# EAGLE design SparkFun_decade_resistance_box (EAGLE 6.5.0)
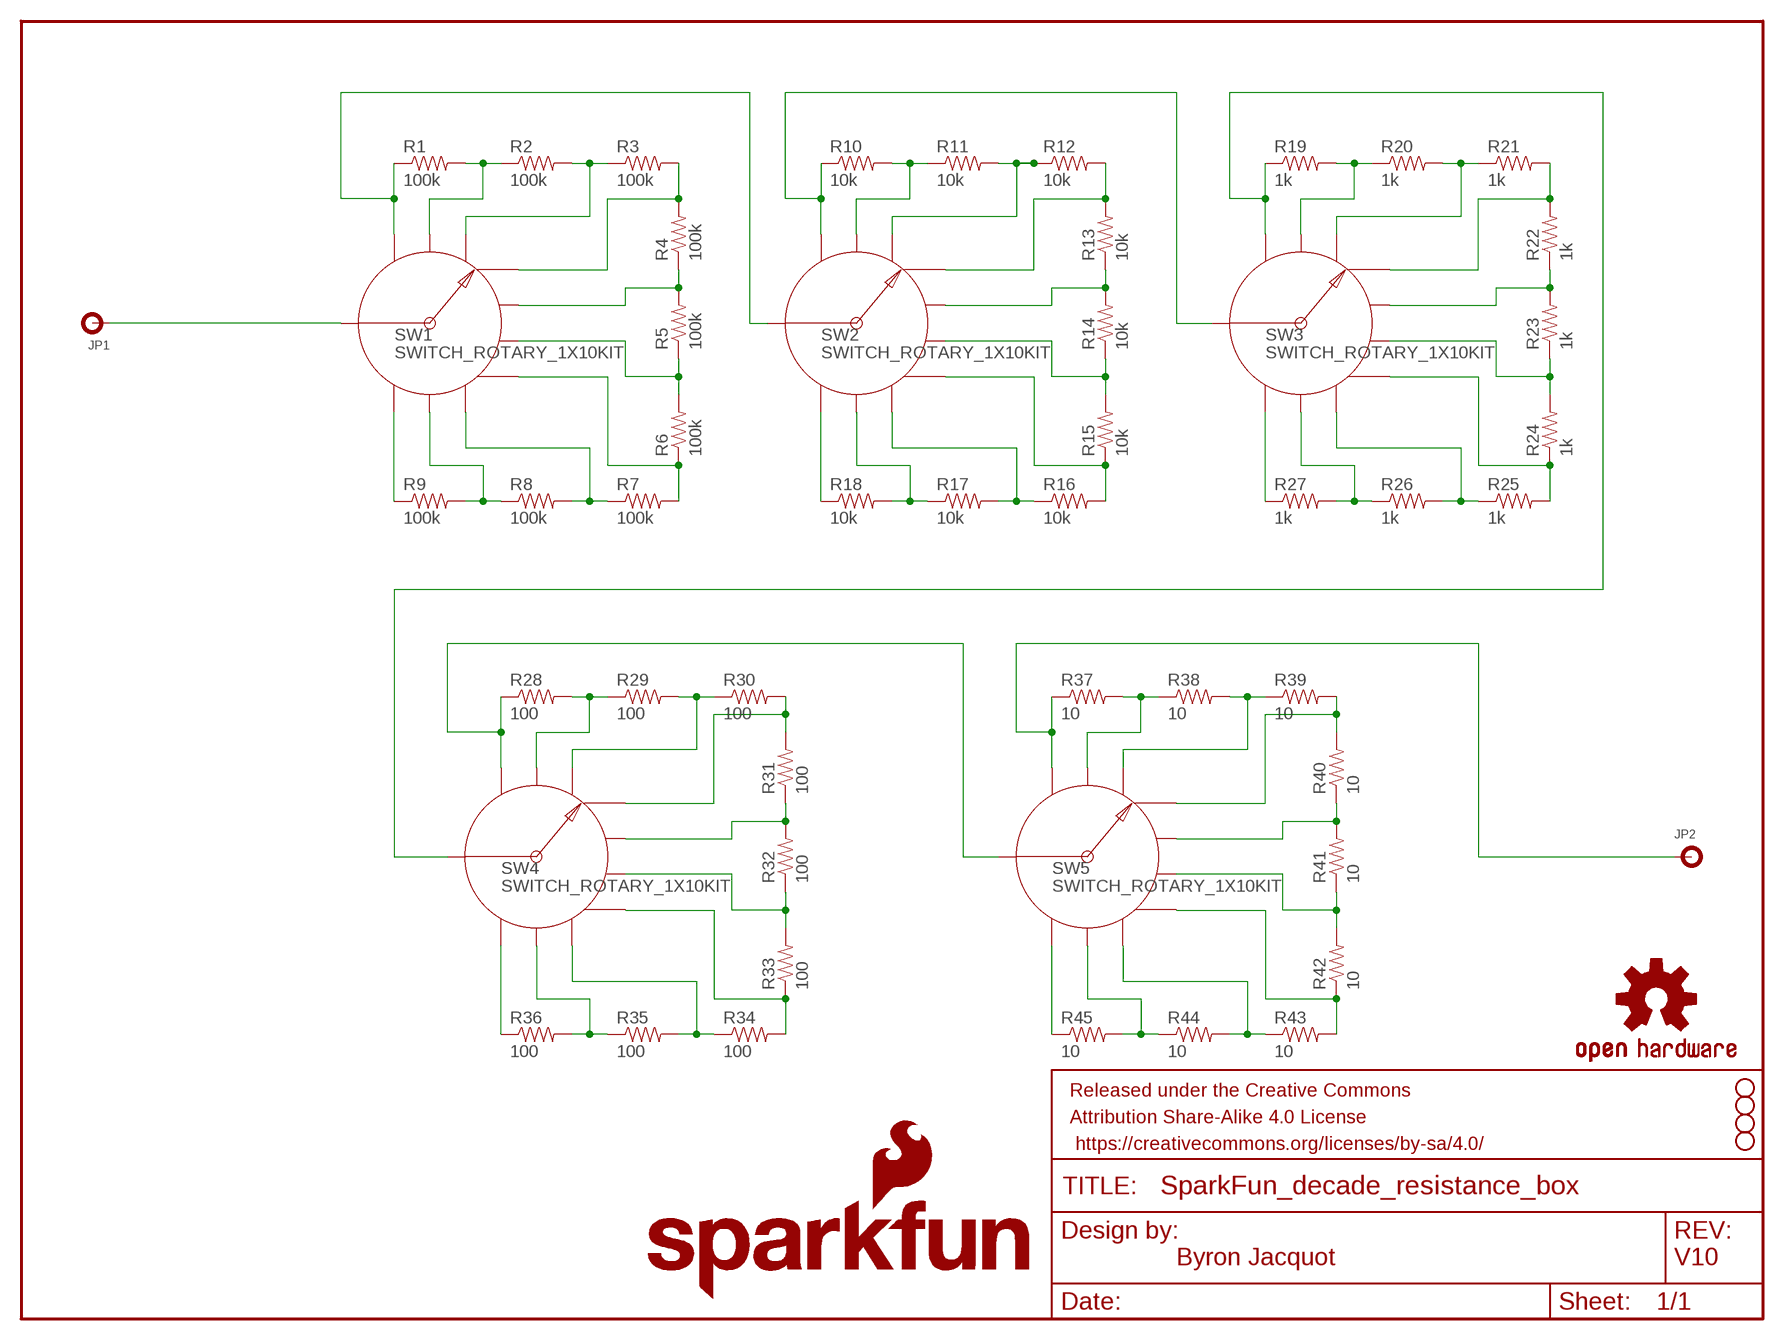
[diagram p0: schematic, sheet 1]

## Parts
FRAME1  FRAME-LETTER  [CREATIVE_COMMONS]
JP1  BANANA-JACK  [BANANA-JACK]
JP2  BANANA-JACK  [BANANA-JACK]
LOGO1  OSHW-LOGOL  [OSHW-LOGO-L]
LOGO2  SFE_LOGO_NAME_FLAME.2_INCH  [SFE_LOGO_NAME_FLAME_.2]
LOGO3  SFE_LOGO_NAME_FLAME.5_INCH  [SFE_LOGO_NAME_FLAME_.5]
LOGO4  OSHW-LOGOL  [OSHW-LOGO-L]
R1  100k  100KOHM-1/4W-1%(PTH)VERT-KIT  [AXIAL-0.1EZ]
R2  100k  100KOHM-1/4W-1%(PTH)VERT-KIT  [AXIAL-0.1EZ]
R3  100k  100KOHM-1/4W-1%(PTH)VERT-KIT  [AXIAL-0.1EZ]
R4  100k  100KOHM-1/4W-1%(PTH)VERT-KIT  [AXIAL-0.1EZ]
R5  100k  100KOHM-1/4W-1%(PTH)VERT-KIT  [AXIAL-0.1EZ]
R6  100k  100KOHM-1/4W-1%(PTH)VERT-KIT  [AXIAL-0.1EZ]
R7  100k  100KOHM-1/4W-1%(PTH)VERT-KIT  [AXIAL-0.1EZ]
R8  100k  100KOHM-1/4W-1%(PTH)VERT-KIT  [AXIAL-0.1EZ]
R9  100k  100KOHM-1/4W-1%(PTH)VERT-KIT  [AXIAL-0.1EZ]
R10  10k  10KOHM-1/4W-1%(PTH)VERT-KIT  [AXIAL-0.1EZ]
R11  10k  10KOHM-1/4W-1%(PTH)VERT-KIT  [AXIAL-0.1EZ]
R12  10k  10KOHM-1/4W-1%(PTH)VERT-KIT  [AXIAL-0.1EZ]
R13  10k  10KOHM-1/4W-1%(PTH)VERT-KIT  [AXIAL-0.1EZ]
R14  10k  10KOHM-1/4W-1%(PTH)VERT-KIT  [AXIAL-0.1EZ]
R15  10k  10KOHM-1/4W-1%(PTH)VERT-KIT  [AXIAL-0.1EZ]
R16  10k  10KOHM-1/4W-1%(PTH)VERT-KIT  [AXIAL-0.1EZ]
R17  10k  10KOHM-1/4W-1%(PTH)VERT-KIT  [AXIAL-0.1EZ]
R18  10k  10KOHM-1/4W-1%(PTH)VERT-KIT  [AXIAL-0.1EZ]
R19  1k  1KOHM-1/4W-1%(PTH)VERT-KIT  [AXIAL-0.1EZ]
R20  1k  1KOHM-1/4W-1%(PTH)VERT-KIT  [AXIAL-0.1EZ]
R21  1k  1KOHM-1/4W-1%(PTH)VERT-KIT  [AXIAL-0.1EZ]
R22  1k  1KOHM-1/4W-1%(PTH)VERT-KIT  [AXIAL-0.1EZ]
R23  1k  1KOHM-1/4W-1%(PTH)VERT-KIT  [AXIAL-0.1EZ]
R24  1k  1KOHM-1/4W-1%(PTH)VERT-KIT  [AXIAL-0.1EZ]
R25  1k  1KOHM-1/4W-1%(PTH)VERT-KIT  [AXIAL-0.1EZ]
R26  1k  1KOHM-1/4W-1%(PTH)VERT-KIT  [AXIAL-0.1EZ]
R27  1k  1KOHM-1/4W-1%(PTH)VERT-KIT  [AXIAL-0.1EZ]
R28  100  100OHM-1/4W-1%(PTH)VERT-KIT  [AXIAL-0.1EZ]
R29  100  100OHM-1/4W-1%(PTH)VERT-KIT  [AXIAL-0.1EZ]
R30  100  100OHM-1/4W-1%(PTH)VERT-KIT  [AXIAL-0.1EZ]
R31  100  100OHM-1/4W-1%(PTH)VERT-KIT  [AXIAL-0.1EZ]
R32  100  100OHM-1/4W-1%(PTH)VERT-KIT  [AXIAL-0.1EZ]
R33  100  100OHM-1/4W-1%(PTH)VERT-KIT  [AXIAL-0.1EZ]
R34  100  100OHM-1/4W-1%(PTH)VERT-KIT  [AXIAL-0.1EZ]
R35  100  100OHM-1/4W-1%(PTH)VERT-KIT  [AXIAL-0.1EZ]
R36  100  100OHM-1/4W-1%(PTH)VERT-KIT  [AXIAL-0.1EZ]
R37  10  10OHM-1/4W-1%(PTH)VERT-KIT  [AXIAL-0.1EZ]
R38  10  10OHM-1/4W-1%(PTH)VERT-KIT  [AXIAL-0.1EZ]
R39  10  10OHM-1/4W-1%(PTH)VERT-KIT  [AXIAL-0.1EZ]
R40  10  10OHM-1/4W-1%(PTH)VERT-KIT  [AXIAL-0.1EZ]
R41  10  10OHM-1/4W-1%(PTH)VERT-KIT  [AXIAL-0.1EZ]
R42  10  10OHM-1/4W-1%(PTH)VERT-KIT  [AXIAL-0.1EZ]
R43  10  10OHM-1/4W-1%(PTH)VERT-KIT  [AXIAL-0.1EZ]
R44  10  10OHM-1/4W-1%(PTH)VERT-KIT  [AXIAL-0.1EZ]
R45  10  10OHM-1/4W-1%(PTH)VERT-KIT  [AXIAL-0.1EZ]
STANDOFF1  STAND-OFF  [STAND-OFF]
STANDOFF2  STAND-OFF  [STAND-OFF]
STANDOFF3  STAND-OFF  [STAND-OFF]
STANDOFF4  STAND-OFF  [STAND-OFF]
SW1  SWITCH_ROTARY_1X10KIT  [ROTARY_SWITCH_1X10_KIT]
SW2  SWITCH_ROTARY_1X10KIT  [ROTARY_SWITCH_1X10_KIT]
SW3  SWITCH_ROTARY_1X10KIT  [ROTARY_SWITCH_1X10_KIT]
SW4  SWITCH_ROTARY_1X10KIT  [ROTARY_SWITCH_1X10_KIT]
SW5  SWITCH_ROTARY_1X10KIT  [ROTARY_SWITCH_1X10_KIT]

## Nets
N$1: R1.P$1 SW1.1 SW2.COMMON
N$2: R1.P$2 R2.P$1 SW1.2
N$3: R2.P$2 R3.P$1 SW1.3
N$4: R3.P$2 R4.P$2 SW1.4
N$5: R4.P$1 R5.P$2 SW1.5
N$6: R5.P$1 R6.P$2 SW1.6
N$7: R6.P$1 R7.P$2 SW1.7
N$8: R7.P$1 R8.P$2 SW1.8
N$9: R8.P$1 R9.P$2 SW1.9
N$10: R9.P$1 SW1.10
N$11: R10.P$1 SW2.1 SW3.COMMON
N$12: R10.P$2 R11.P$1 SW2.2
N$13: R11.P$2 R12.P$1 SW2.3
N$14: R12.P$2 R13.P$2 SW2.4
N$15: R13.P$1 R14.P$2 SW2.5
N$16: R14.P$1 R15.P$2 SW2.6
N$17: JP1.P$1 SW1.COMMON
N$18: R15.P$1 R16.P$2 SW2.7
N$19: R16.P$1 R17.P$2 SW2.8
N$20: R17.P$1 R18.P$2 SW2.9
N$21: R18.P$1 SW2.10
N$23: R19.P$1 SW3.1 SW4.COMMON
N$24: R19.P$2 R20.P$1 SW3.2
N$25: R20.P$2 R21.P$1 SW3.3
N$26: R21.P$2 R22.P$2 SW3.4
N$27: R22.P$1 R23.P$2 SW3.5
N$28: R23.P$1 R24.P$2 SW3.6
N$29: R24.P$1 R25.P$2 SW3.7
N$30: R25.P$1 R26.P$2 SW3.8
N$31: R26.P$1 R27.P$2 SW3.9
N$32: R27.P$1 SW3.10
N$34: R28.P$1 SW4.1 SW5.COMMON
N$35: R28.P$2 R29.P$1 SW4.2
N$36: R29.P$2 R30.P$1 SW4.3
N$37: R30.P$2 R31.P$2 SW4.4
N$38: R31.P$1 R32.P$2 SW4.5
N$39: R32.P$1 R33.P$2 SW4.6
N$40: R33.P$1 R34.P$2 SW4.7
N$41: R34.P$1 R35.P$2 SW4.8
N$42: R35.P$1 R36.P$2 SW4.9
N$43: R36.P$1 SW4.10
N$45: JP2.P$1 R37.P$1 SW5.1
N$46: R37.P$2 R38.P$1 SW5.2
N$47: R38.P$2 R39.P$1 SW5.3
N$48: R39.P$2 R40.P$2 SW5.4
N$49: R40.P$1 R41.P$2 SW5.5
N$50: R41.P$1 R42.P$2 SW5.6
N$51: R42.P$1 R43.P$2 SW5.7
N$52: R43.P$1 R44.P$2 SW5.8
N$53: R44.P$1 R45.P$2 SW5.9
N$54: R45.P$1 SW5.10

## Notes on the sheet
- Byron Jacquot | V10

## Library data of the parts
FRAME1 = SparkFun-Aesthetics:FRAME-LETTER: Schematic Frame Standard 8.5x11 US Letter frame
JP1 JP2 = Testing:BANANA-JACK: Single Banana jack. PRT-09739 (red) or PRT-09740 (blk) Footprint is a bit strange. The component itself has an threaded, insulated body that goes through the board, with a small threaded metal stud coming off the back. The intent of this package is that the post goes through a milled obling hole, and a small wire would be used to connect from the PCB pad to the metal contact on the post.
LOGO1 LOGO4 = SparkFun-Aesthetics:OSHW-LOGO: Open Source Hardware Logo This logo indicates the piece of hardware it is found on incorporates a OSHW license and/or adheres to the definition of open source hardware found here: http://freedomdefined.org/OSHW
LOGO2 LOGO3 = SparkFun-Aesthetics:SFE_LOGO_NAME_FLAME: SFE Logo, name and flame This is the SparkFun full logo. The logo on the schematic will always be the same size; the package variant is the height of the flame part of the logo. Default layer for the logo on the board is tSilk.
R1-R9 = SparkFun-Resistors:100KOHM-1/4W-1%(PTH): RES-12184; PROD_ID: RES-12184; VALUE: 100K
R10-R18 = SparkFun-Resistors:10KOHM-1/4W-1%(PTH): RES-12183; PROD_ID: RES-12183
R19-R27 = SparkFun-Resistors:1KOHM-1/4W-1%(PTH): RES-12182; PROD_ID: RES-12182; VALUE: 1K
R28-R36 = SparkFun-Resistors:100OHM-1/4W-1%(PTH): RES-12181; PROD_ID: RES-12181
R37-R45 = SparkFun-Resistors:10OHM-1/4W-1%(PTH): RES-12180; PROD_ID: RES-12180; VALUE: 10.0
STANDOFF1-STANDOFF4 = SparkFun-Electromechanical:STAND-OFF: #4 Stand Off This is the mechanical footprint for a #4 phillips button head screw. Use the keepout ring to avoid running the screw head into surrounding components. SKU : PRT-00447
SW1-SW5 = Testing:SWITCH_ROTARY_1X10: SWCH-12120; PROD_ID: SWCH-12120; VALUE: 1x10

## Board
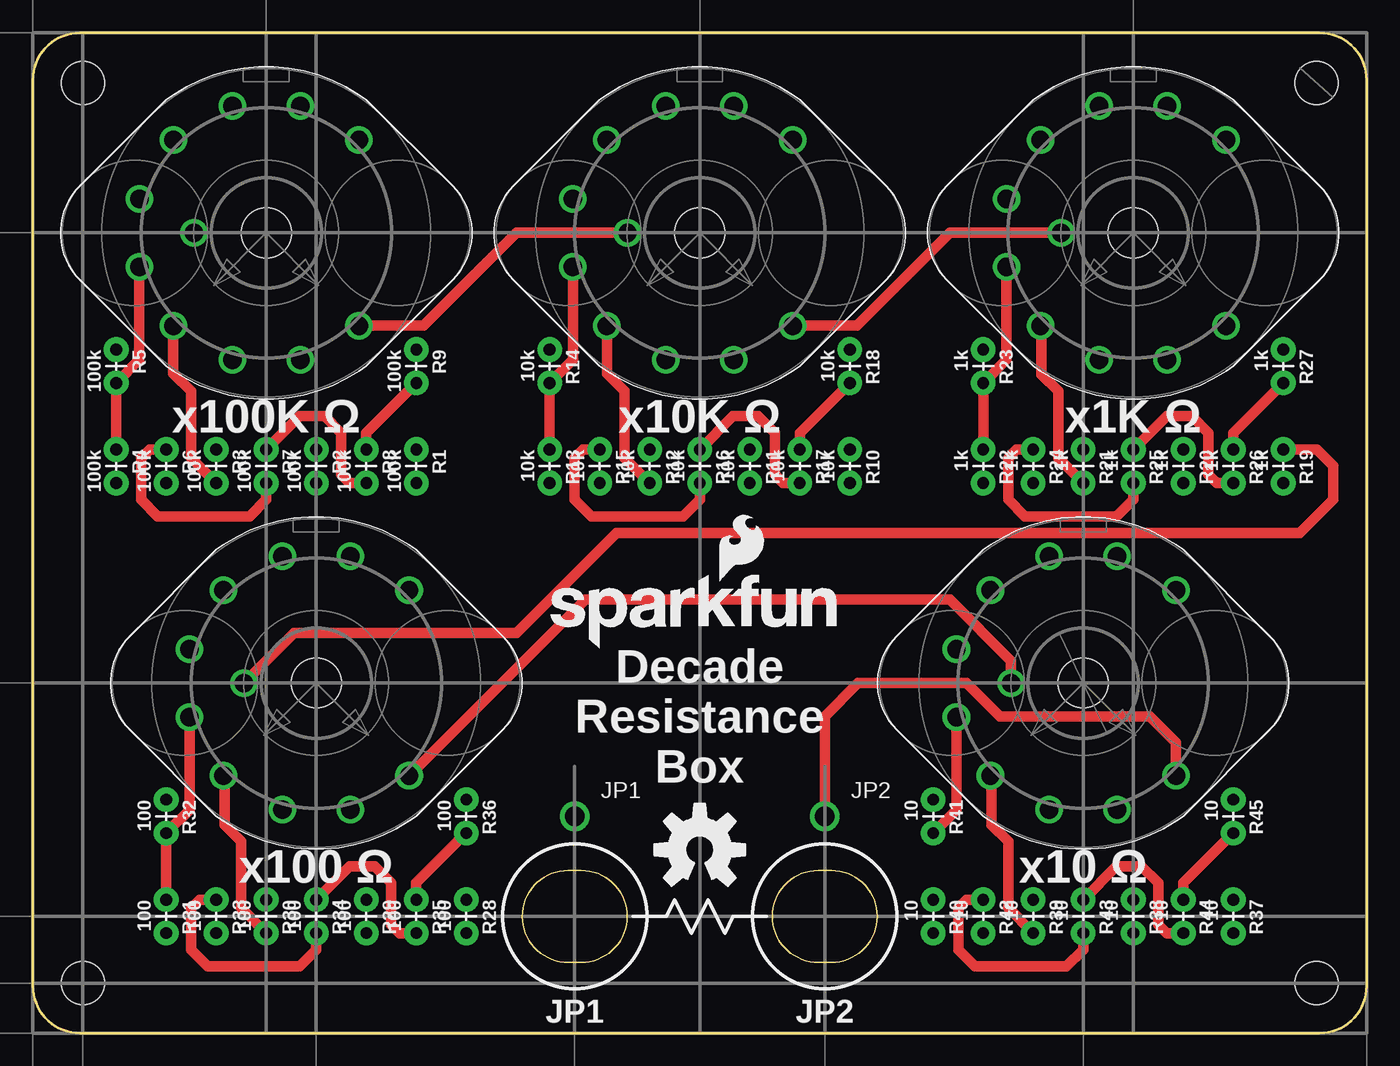
[diagram p1: board, top side]
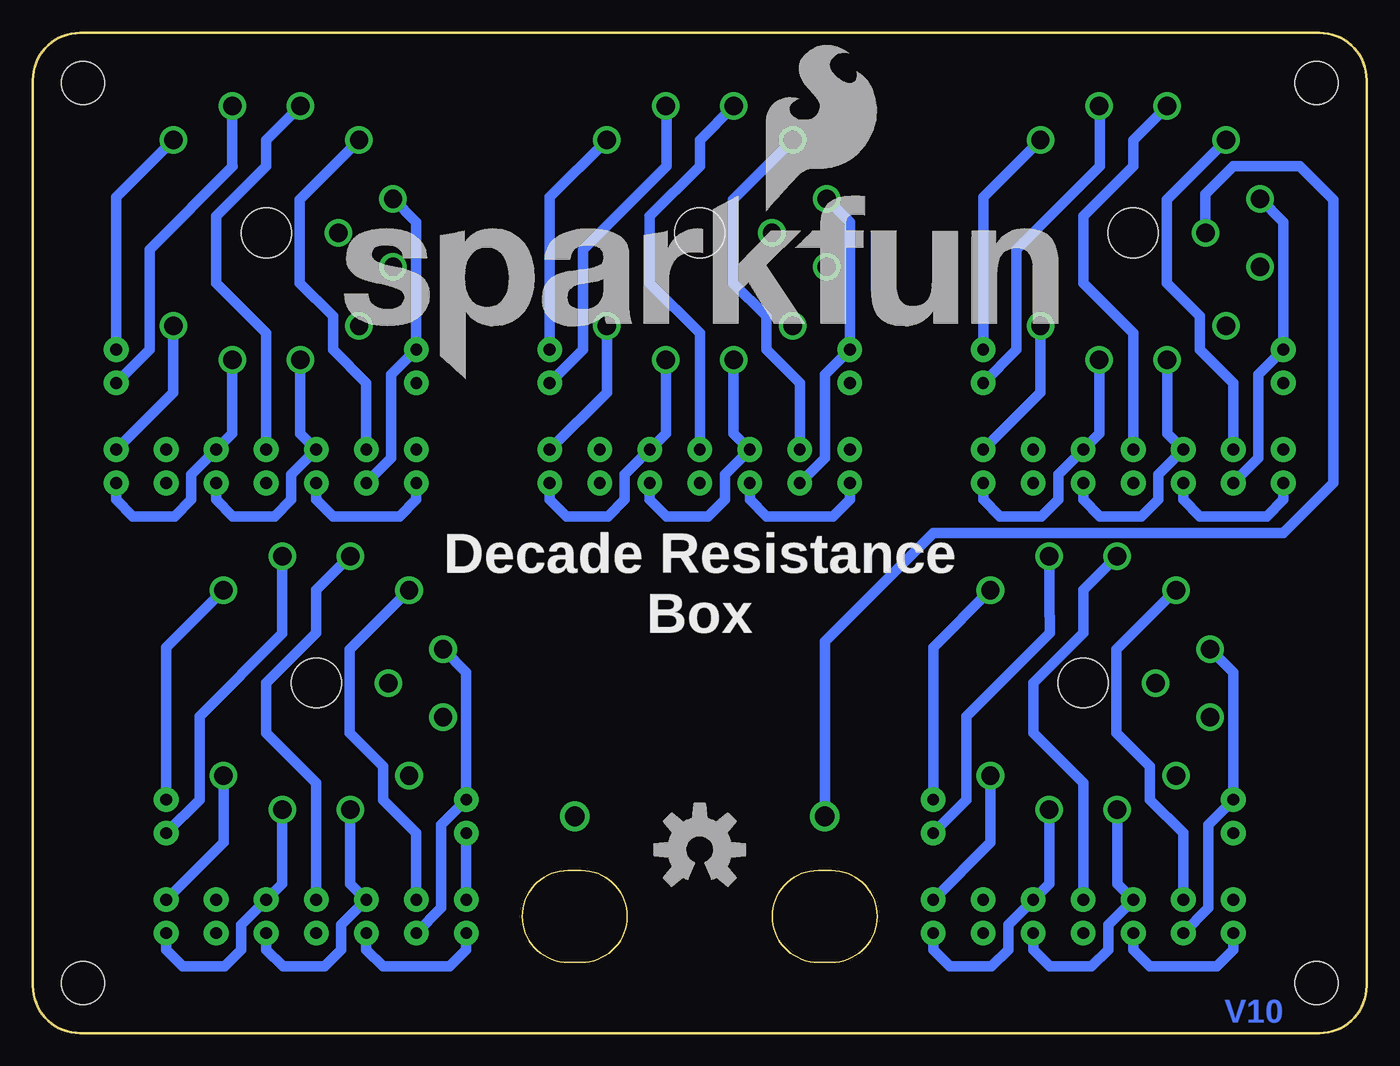
[diagram p2: board, bottom side, seen from below]

Size 101.6 x 76.2 mm. Coordinates in mm from the lower left corner, seen from the top.
Outline: 0,72.61 0,3.59 arc90 3.59,0 98.01,0 arc90 101.6,3.59 101.6,72.61 arc90 98.01,76.2 3.59,76.2 arc90 0,72.61
Copper layers (1*16): Top 0.035mm / dielectric 1.5mm / Bottom 0.035mm
Design rules "SparkFun-2-layer": minimum track width 7mil, minimum drill 15mil, track to track 8mil, track to pad 8mil, pad to pad 8mil, via to via 8mil, smd to smd 8mil, copper to edge 8mil, drill to drill 8mil, minimum pad ring 12mil, minimum via ring 10mil, stop-mask expansion 4mil, vias tented up to drill 20mil, thermal gap 10mil
Holes 3.81 mm at 17.78,60.96 50.8,60.96 83.82,60.96 80.01,26.67 21.59,26.67

### Footprints (pad centres in the part's own frame; a part is rotated, then mirrored left to right if it is on the bottom)
BANANA-JACK = drill 1.5: P$1 0,7.62
AXIAL-0.1EZ = drill 0.9 pad 1.88: P$1 0,0; P$2 2.54,0
STAND-OFF = hole 3.302: 0,0
ROTARY_SWITCH_1X10_KIT = drill 1.4: 1 7.071,7.071; 2 9.659,2.588; 3 9.659,-2.588; 4 7.071,-7.071; 5 2.588,-9.659; 6 -2.588,-9.659; 7 -7.071,-7.071; 8 -9.659,-2.588; 9 -9.659,2.588; 10 -7.071,7.071; COMMON 0,-5.5

### Placement (x,y rotation side)
FRAME1  24.13,-33.02 0 top  (outside the outline)
JP1  41.27,8.89 0 top
JP2  60.33,8.89 0 top
LOGO1  50.8,13.97 0 top
LOGO2  38.73,29.21 0 top
LOGO3  78.74,49.53 0 bottom
LOGO4  50.8,13.97 0 bottom
R1  29.21,44.45 270 top
R2  21.59,44.45 270 top
R3  13.97,44.45 270 top
R4  6.35,44.45 270 top
R5  6.35,52.07 270 top
R6  10.16,44.45 270 top
R7  17.78,44.45 270 top
R8  25.4,44.45 270 top
R9  29.21,52.07 270 top
R10  62.23,44.45 270 top
R11  54.61,44.45 270 top
R12  46.99,44.45 270 top
R13  39.37,44.45 270 top
R14  39.37,52.07 270 top
R15  43.18,44.45 270 top
R16  50.8,44.45 270 top
R17  58.42,44.45 270 top
R18  62.23,52.07 270 top
R19  95.25,44.45 270 top
R20  87.63,44.45 270 top
R21  80.01,44.45 270 top
R22  72.39,44.45 270 top
R23  72.39,52.07 270 top
R24  76.2,44.45 270 top
R25  83.82,44.45 270 top
R26  91.44,44.45 270 top
R27  95.25,52.07 270 top
R28  33.02,10.16 270 top
R29  25.4,10.16 270 top
R30  17.78,10.16 270 top
R31  10.16,10.16 270 top
R32  10.16,17.78 270 top
R33  13.97,10.16 270 top
R34  21.59,10.16 270 top
R35  29.21,10.16 270 top
R36  33.02,17.78 270 top
R37  91.44,10.16 270 top
R38  83.82,10.16 270 top
R39  76.2,10.16 270 top
R40  68.58,10.16 270 top
R41  68.58,17.78 270 top
R42  72.39,10.16 270 top
R43  80.01,10.16 270 top
R44  87.63,10.16 270 top
R45  91.44,17.78 270 top
STANDOFF1  3.81,72.39 0 top
STANDOFF2  3.81,3.81 0 top
STANDOFF3  97.79,3.81 0 top
STANDOFF4  97.79,72.39 0 top
SW1  17.78,60.96 270 top
SW2  50.8,60.96 270 top
SW3  83.82,60.96 270 top
SW4  21.59,26.67 270 top
SW5  80.01,26.67 270 top

### Tracks (layer width: path | path; a pad name or v marks a point on that pad's centre or on a via)
N$1
  Top 0.813: SW1.1 29.76,53.89 36.83,60.96 SW2.COMMON
  Bottom 0.813: SW1.1 24.85,48.81 R1.P$1
N$2
  Bottom 0.813: SW1.2 20.37,45.67 R2.P$1 23.5,42.55 23.5,40.64 24.77,39.37 27.94,39.37 29.21,40.64 R1.P$2
N$3
  Bottom 0.813: SW1.3 15.19,45.67 R3.P$1 15.88,42.55 15.88,40.64 17.14,39.37 20.32,39.37 21.59,40.64 R2.P$2
N$4
  Top 0.813: SW1.4 10.71,50.25 12.06,48.9 12.06,43.81 R3.P$2
  Bottom 0.813: R3.P$2 13.97,40.64 12.7,39.37 7.62,39.37 6.35,40.64 R4.P$2
N$5
  Top 0.813: SW1.5 8.12,51.3 R5.P$2 R4.P$1
N$6
  Bottom 0.813: R6.P$2 8.26,43.81 8.26,50.16 R5.P$1 6.35,61.78 SW1.6
N$7
  Top 0.813: R6.P$1 8.89,44.45 8.26,43.81 8.26,40.64 9.53,39.37 16.51,39.37 17.78,40.64 R7.P$2
  Bottom 0.813: SW1.7 15.24,63.5 15.24,57.15 12.7,54.61 12.7,52.07 10.16,49.53 R6.P$1
N$8
  Top 0.813: R8.P$2 24.13,41.91 23.5,42.55 23.5,45.72 22.23,46.99 20.32,46.99 R7.P$1
  Bottom 0.813: SW1.8 17.78,68.03 17.78,66.04 21.59,62.23 21.59,57.15 17.78,53.34 R7.P$1
N$9
  Top 0.813: R8.P$1 25.4,45.72 R9.P$2
  Bottom 0.813: SW1.9 20.32,70.57 20.32,66.04 26.67,59.69 26.67,52.07 R9.P$2
N$10
  Bottom 0.813: R9.P$1 29.21,63.67 SW1.10
N$11
  Top 0.813: SW2.1 62.78,53.89 69.85,60.96 SW3.COMMON
  Bottom 0.813: SW2.1 57.87,48.81 R10.P$1
N$12
  Bottom 0.813: SW2.2 53.39,45.67 R11.P$1 56.52,42.55 56.52,40.64 57.78,39.37 60.96,39.37 62.23,40.64 R10.P$2
N$13
  Bottom 0.813: SW2.3 48.21,45.67 R12.P$1 48.9,42.55 48.9,40.64 50.16,39.37 53.34,39.37 54.61,40.64 R11.P$2
N$14
  Top 0.813: SW2.4 43.73,50.25 45.09,48.9 45.09,43.81 R12.P$2
  Bottom 0.813: R13.P$2 39.37,40.64 40.64,39.37 45.72,39.37 46.99,40.64 R12.P$2
N$15
  Top 0.813: SW2.5 41.14,51.3 R14.P$2 R13.P$1
N$16
  Bottom 0.813: SW2.6 39.37,61.78 R14.P$1 41.27,50.16 41.27,43.81 R15.P$2
N$17
  Bottom 0.813: JP1.P$1 41.27,29.84 33.02,38.1 6.35,38.1 2.54,41.91 2.54,63.5 5.08,66.04 10.16,66.04 12.28,63.92 SW1.COMMON
N$18
  Top 0.813: R15.P$1 41.91,44.45 41.27,43.81 41.27,40.64 42.55,39.37 49.53,39.37 50.8,40.64 R16.P$2
  Bottom 0.813: R15.P$1 43.18,49.53 45.72,52.07 45.72,54.61 48.26,57.15 48.26,63.5 SW2.7
N$19
  Top 0.813: R17.P$2 57.15,41.91 56.52,42.55 56.52,45.72 55.24,46.99 53.34,46.99 R16.P$1
  Bottom 0.813: SW2.8 50.8,68.03 50.8,66.04 54.61,62.23 54.61,57.15 50.8,53.34 R16.P$1
N$20
  Top 0.813: R17.P$1 58.42,45.72 R18.P$2
  Bottom 0.813: SW2.9 53.34,70.57 53.34,66.04 59.69,59.69 59.69,52.07 R18.P$2
N$21
  Bottom 0.813: R18.P$1 62.23,63.67 SW2.10
N$23
  Top 0.813: SW4.COMMON 19.9,30.48 36.83,30.48 44.45,38.1 96.52,38.1 99.06,40.64 99.06,43.18 97.79,44.45 R19.P$1
  Bottom 0.813: SW3.1 90.89,48.81 R19.P$1
N$24
  Bottom 0.813: SW3.2 86.41,45.67 R20.P$1 89.53,42.55 89.53,40.64 90.81,39.37 93.98,39.37 95.25,40.64 R19.P$2
N$25
  Bottom 0.813: SW3.3 81.23,45.67 R21.P$1 81.92,42.55 81.92,40.64 83.19,39.37 86.36,39.37 87.63,40.64 R20.P$2
N$26
  Top 0.813: SW3.4 76.83,53.8 76.83,50.16 78.11,48.9 78.11,43.81 R21.P$2
  Bottom 0.813: R22.P$2 72.39,40.64 73.66,39.37 78.74,39.37 80.01,40.64 R21.P$2
N$27
  Top 0.813: SW3.5 74.16,51.3 R23.P$2 R22.P$1
N$28
  Bottom 0.813: SW3.6 72.39,61.78 R23.P$1 74.3,50.16 74.3,43.81 R24.P$2
N$29
  Top 0.813: R24.P$1 74.93,44.45 74.3,43.81 74.3,40.64 75.56,39.37 82.55,39.37 83.82,40.64 R25.P$2
  Bottom 0.813: SW3.7 81.28,63.5 81.28,57.15 78.74,54.61 78.74,52.07 76.2,49.53 R24.P$1
N$30
  Top 0.813: R26.P$2 90.17,41.91 89.53,42.55 89.53,45.72 88.27,46.99 86.36,46.99 R25.P$1
  Bottom 0.813: SW3.8 83.82,68.03 83.82,66.04 87.63,62.23 87.63,57.15 83.82,53.34 R25.P$1
N$31
  Top 0.813: R26.P$1 91.44,45.72 R27.P$2
  Bottom 0.813: SW3.9 86.41,66.09 86.36,66.04 92.71,59.69 92.71,52.07 R27.P$2
N$32
  Bottom 0.813: R27.P$1 95.25,63.67 SW3.10
N$34
  Top 0.813: SW5.COMMON 74.51,28.36 69.85,33.02 42.08,33.02 SW4.1
  Bottom 0.813: SW4.1 28.66,14.52 R28.P$1
N$35
  Bottom 0.813: SW4.2 24.18,11.38 R29.P$1 27.3,8.26 27.3,6.35 28.57,5.08 31.75,5.08 33.02,6.35 R28.P$2
N$36
  Bottom 0.813: SW4.3 19,11.38 R30.P$1 19.68,8.26 19.68,6.35 20.95,5.08 24.13,5.08 25.4,6.35 R29.P$2
N$37
  Top 0.813: SW4.4 14.61,19.51 14.61,15.88 15.88,14.61 15.88,9.53 R30.P$2
  Bottom 0.813: R31.P$2 10.16,6.35 11.43,5.08 16.51,5.08 17.78,6.35 R30.P$2
N$38
  Top 0.813: SW4.5 11.93,17.01 R32.P$2 R31.P$1
N$39
  Bottom 0.813: SW4.6 10.16,27.49 R32.P$1 12.06,15.88 12.06,9.53 R33.P$2
N$40
  Top 0.813: R33.P$1 12.7,10.16 12.06,9.53 12.06,6.35 13.34,5.08 20.32,5.08 21.59,6.35 R34.P$2
  Bottom 0.813: R33.P$1 13.97,15.24 16.51,17.78 16.51,20.32 19.05,22.86 19.05,29.21 SW4.7
N$41
  Top 0.813: R35.P$2 27.94,7.62 27.3,8.26 27.3,11.43 26.04,12.7 24.13,12.7 R34.P$1
  Bottom 0.813: SW4.8 21.59,33.74 21.59,30.48 25.4,26.67 25.4,22.86 21.59,19.05 R34.P$1
N$42
  Top 0.813: R35.P$1 29.21,11.43 R36.P$2
  Bottom 0.813: SW4.9 24.18,31.8 24.13,31.75 24.13,30.48 30.48,24.13 30.48,17.78 R36.P$2
N$43
  Bottom 0.813: R36.P$1 33.02,29.38 SW4.10
N$45
  Top 0.813: SW5.1 87.08,22.14 85.09,24.13 73.66,24.13 71.12,26.67 62.87,26.67 60.33,24.13 JP2.P$1
  Bottom 0.813: SW5.1 87.08,14.52 R37.P$1
N$46
  Bottom 0.813: SW5.2 82.6,11.38 R38.P$1 85.72,8.26 85.72,6.35 87,5.08 90.17,5.08 91.44,6.35 R37.P$2
N$47
  Bottom 0.813: SW5.3 77.42,11.38 R39.P$1 78.11,8.26 78.11,6.35 79.38,5.08 82.55,5.08 83.82,6.35 R38.P$2
N$48
  Top 0.813: SW5.4 73.03,19.51 73.03,15.88 74.3,14.61 74.3,9.53 R39.P$2
  Bottom 0.813: R40.P$2 68.58,6.35 69.85,5.08 74.93,5.08 76.2,6.35 R39.P$2
N$49
  Top 0.813: SW5.5 70.35,17.01 R41.P$2
  Bottom 0.813: R41.P$2 R40.P$1
N$50
  Bottom 0.813: SW5.6 68.58,27.49 R41.P$1 70.48,15.88 70.48,9.53 R42.P$2
N$51
  Top 0.813: R42.P$1 71.12,10.16 70.48,9.53 70.48,6.35 71.75,5.08 78.74,5.08 80.01,6.35 R43.P$2
  Bottom 0.813: R42.P$1 72.39,15.24 74.93,17.78 74.93,20.32 77.47,22.86 77.47,29.21 SW5.7
N$52
  Top 0.813: R44.P$2 86.36,7.62 85.72,8.26 85.72,11.43 84.45,12.7 82.55,12.7 R43.P$1
  Bottom 0.813: SW5.8 80.01,33.74 80.01,30.48 83.82,26.67 83.82,22.86 80.01,19.05 R43.P$1
N$53
  Top 0.813: R44.P$1 87.63,11.43 R45.P$2
  Bottom 0.813: R45.P$2 88.9,17.78 88.9,24.13 82.6,30.43 SW5.9
N$54
  Bottom 0.813: R45.P$1 91.44,29.38 SW5.10

### Text on the board
Bottom: V10
tPlace: x100K Ω | x10K Ω | x1K Ω | Decade / Resistance / Box | x100 Ω | x10 Ω | JP1 | JP2
bPlace: Decade Resistance / Box
tDocu: Byron Jacquot